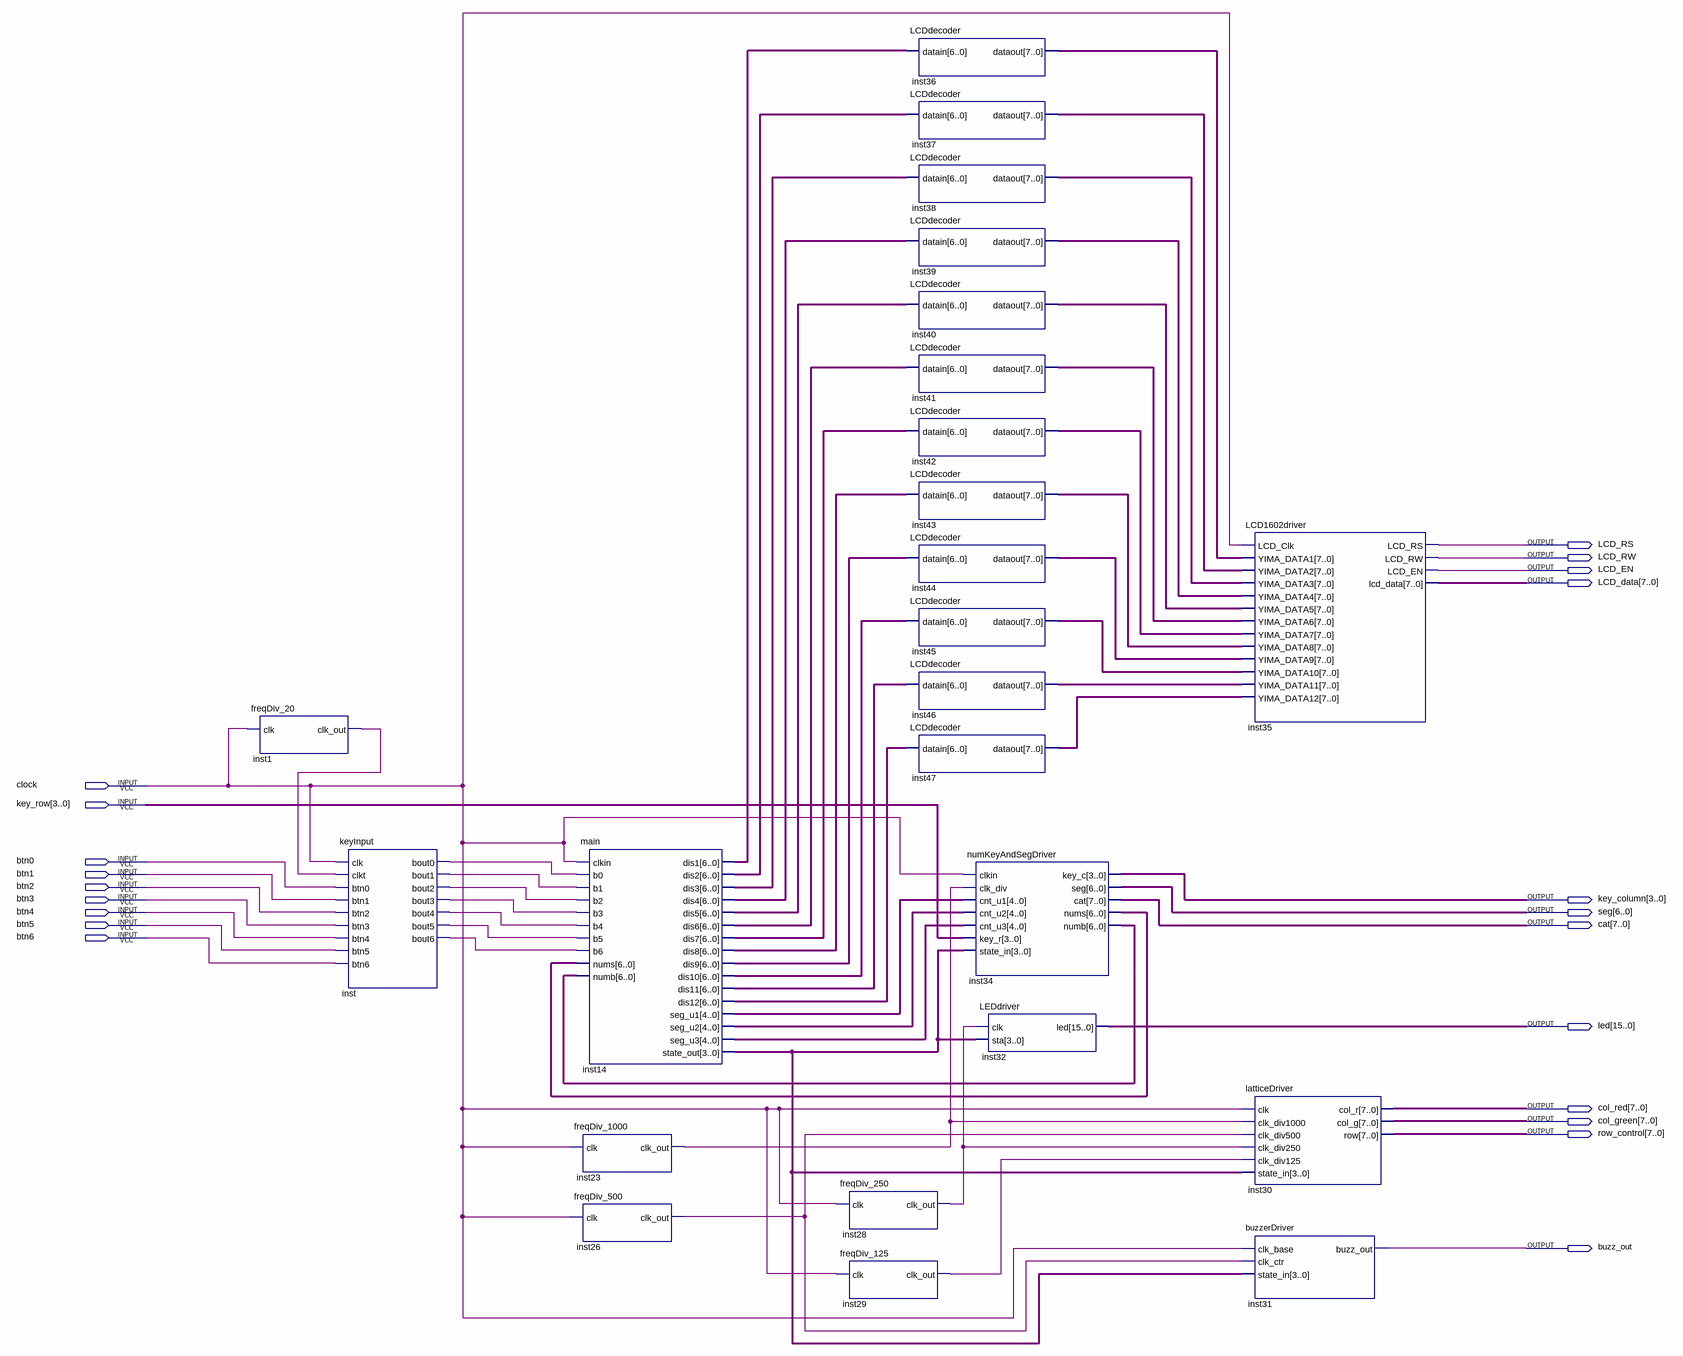
[diagram p0: schematic sheet]
// Quartus schematic mediKit.bdf as structural Verilog: 24 symbols, 21 pins
module mediKit (
  input  clock,
  input  [3:0] key_row,
  input  btn0,
  input  btn1,
  input  btn2,
  input  btn3,
  input  btn4,
  input  btn5,
  input  btn6,
  output LCD_RS,
  output LCD_RW,
  output LCD_EN,
  output [7:0] LCD_data,
  output [3:0] key_column,
  output [6:0] seg,
  output [7:0] cat,
  output [15:0] led,
  output [7:0] col_red,
  output [7:0] col_green,
  output [7:0] row_control,
  output buzz_out
);

  wire inst1_clk_out, inst23_clk_out, inst26_clk_out, inst28_clk_out, inst29_clk_out, inst_bout0, inst_bout1,
       inst_bout2, inst_bout3, inst_bout4, inst_bout5, inst_bout6;
  wire [3:0] inst14_state_out;
  wire [4:0] inst14_seg_u1, inst14_seg_u2, inst14_seg_u3;
  wire [6:0] inst14_dis1, inst14_dis2, inst14_dis3, inst14_dis4, inst14_dis5, inst14_dis6, inst14_dis7,
       inst14_dis8, inst14_dis9, inst14_dis10, inst14_dis11, inst14_dis12, inst34_numb, inst34_nums;
  wire [7:0] inst36_dataout, inst37_dataout, inst38_dataout, inst39_dataout, inst40_dataout, inst41_dataout,
       inst42_dataout, inst43_dataout, inst44_dataout, inst45_dataout, inst46_dataout, inst47_dataout;

  freqDiv_20 inst1 (.clk(clock), .clk_out(inst1_clk_out));
  keyInput inst (
    .clk(clock), .clkt(inst1_clk_out), .btn0(btn0), .btn1(btn1), .btn2(btn2), .btn3(btn3), .btn4(btn4),
    .btn5(btn5), .btn6(btn6), .bout0(inst_bout0), .bout1(inst_bout1), .bout2(inst_bout2), .bout3(inst_bout3),
    .bout4(inst_bout4), .bout5(inst_bout5), .bout6(inst_bout6));
  main inst14 (
    .clkin(clock), .b0(inst_bout0), .b1(inst_bout1), .b2(inst_bout2), .b3(inst_bout3), .b4(inst_bout4),
    .b5(inst_bout5), .b6(inst_bout6), .nums(inst34_nums), .numb(inst34_numb), .dis1(inst14_dis1),
    .dis2(inst14_dis2), .dis3(inst14_dis3), .dis4(inst14_dis4), .dis5(inst14_dis5), .dis6(inst14_dis6),
    .dis7(inst14_dis7), .dis8(inst14_dis8), .dis9(inst14_dis9), .dis10(inst14_dis10), .dis11(inst14_dis11),
    .dis12(inst14_dis12), .seg_u1(inst14_seg_u1), .seg_u2(inst14_seg_u2), .seg_u3(inst14_seg_u3),
    .state_out(inst14_state_out));
  freqDiv_1000 inst23 (.clk(clock), .clk_out(inst23_clk_out));
  freqDiv_500 inst26 (.clk(clock), .clk_out(inst26_clk_out));
  freqDiv_250 inst28 (.clk(clock), .clk_out(inst28_clk_out));
  freqDiv_125 inst29 (.clk(clock), .clk_out(inst29_clk_out));
  LCDdecoder inst36 (.datain(inst14_dis1), .dataout(inst36_dataout));
  LCDdecoder inst37 (.datain(inst14_dis2), .dataout(inst37_dataout));
  LCDdecoder inst38 (.datain(inst14_dis3), .dataout(inst38_dataout));
  LCDdecoder inst39 (.datain(inst14_dis4), .dataout(inst39_dataout));
  LCDdecoder inst40 (.datain(inst14_dis5), .dataout(inst40_dataout));
  LCDdecoder inst41 (.datain(inst14_dis6), .dataout(inst41_dataout));
  LCDdecoder inst42 (.datain(inst14_dis7), .dataout(inst42_dataout));
  LCDdecoder inst43 (.datain(inst14_dis8), .dataout(inst43_dataout));
  LCDdecoder inst44 (.datain(inst14_dis9), .dataout(inst44_dataout));
  LCDdecoder inst45 (.datain(inst14_dis10), .dataout(inst45_dataout));
  LCDdecoder inst46 (.datain(inst14_dis11), .dataout(inst46_dataout));
  LCDdecoder inst47 (.datain(inst14_dis12), .dataout(inst47_dataout));
  numKeyAndSegDriver inst34 (
    .clkin(clock), .clk_div(inst23_clk_out), .cnt_u1(inst14_seg_u1), .cnt_u2(inst14_seg_u2),
    .cnt_u3(inst14_seg_u3), .key_r(key_row), .state_in(inst14_state_out), .key_c(key_column), .seg(seg),
    .cat(cat), .nums(inst34_nums), .numb(inst34_numb));
  LEDdriver inst32 (.clk(inst28_clk_out), .sta(inst14_state_out), .led(led));
  LCD1602driver inst35 (
    .LCD_Clk(clock), .YIMA_DATA1(inst36_dataout), .YIMA_DATA2(inst37_dataout), .YIMA_DATA3(inst38_dataout),
    .YIMA_DATA4(inst39_dataout), .YIMA_DATA5(inst40_dataout), .YIMA_DATA6(inst41_dataout),
    .YIMA_DATA7(inst42_dataout), .YIMA_DATA8(inst43_dataout), .YIMA_DATA9(inst44_dataout),
    .YIMA_DATA10(inst45_dataout), .YIMA_DATA11(inst46_dataout), .YIMA_DATA12(inst47_dataout),
    .LCD_RS(LCD_RS), .LCD_RW(LCD_RW), .LCD_EN(LCD_EN), .lcd_data(LCD_data));
  latticeDriver inst30 (
    .clk(clock), .clk_div1000(inst23_clk_out), .clk_div500(inst26_clk_out), .clk_div250(inst28_clk_out),
    .clk_div125(inst29_clk_out), .state_in(inst14_state_out), .col_r(col_red), .col_g(col_green),
    .row(row_control));
  buzzerDriver inst31 (.clk_base(clock), .clk_ctr(inst26_clk_out), .state_in(inst14_state_out), .buzz_out(buzz_out));
endmodule
